# EAGLE design CCS811 Rev B (EAGLE 6.6.0)
COMPANY: ADAFRUIT INDUSTRIES; DRAWN: KTOWN; REV: A
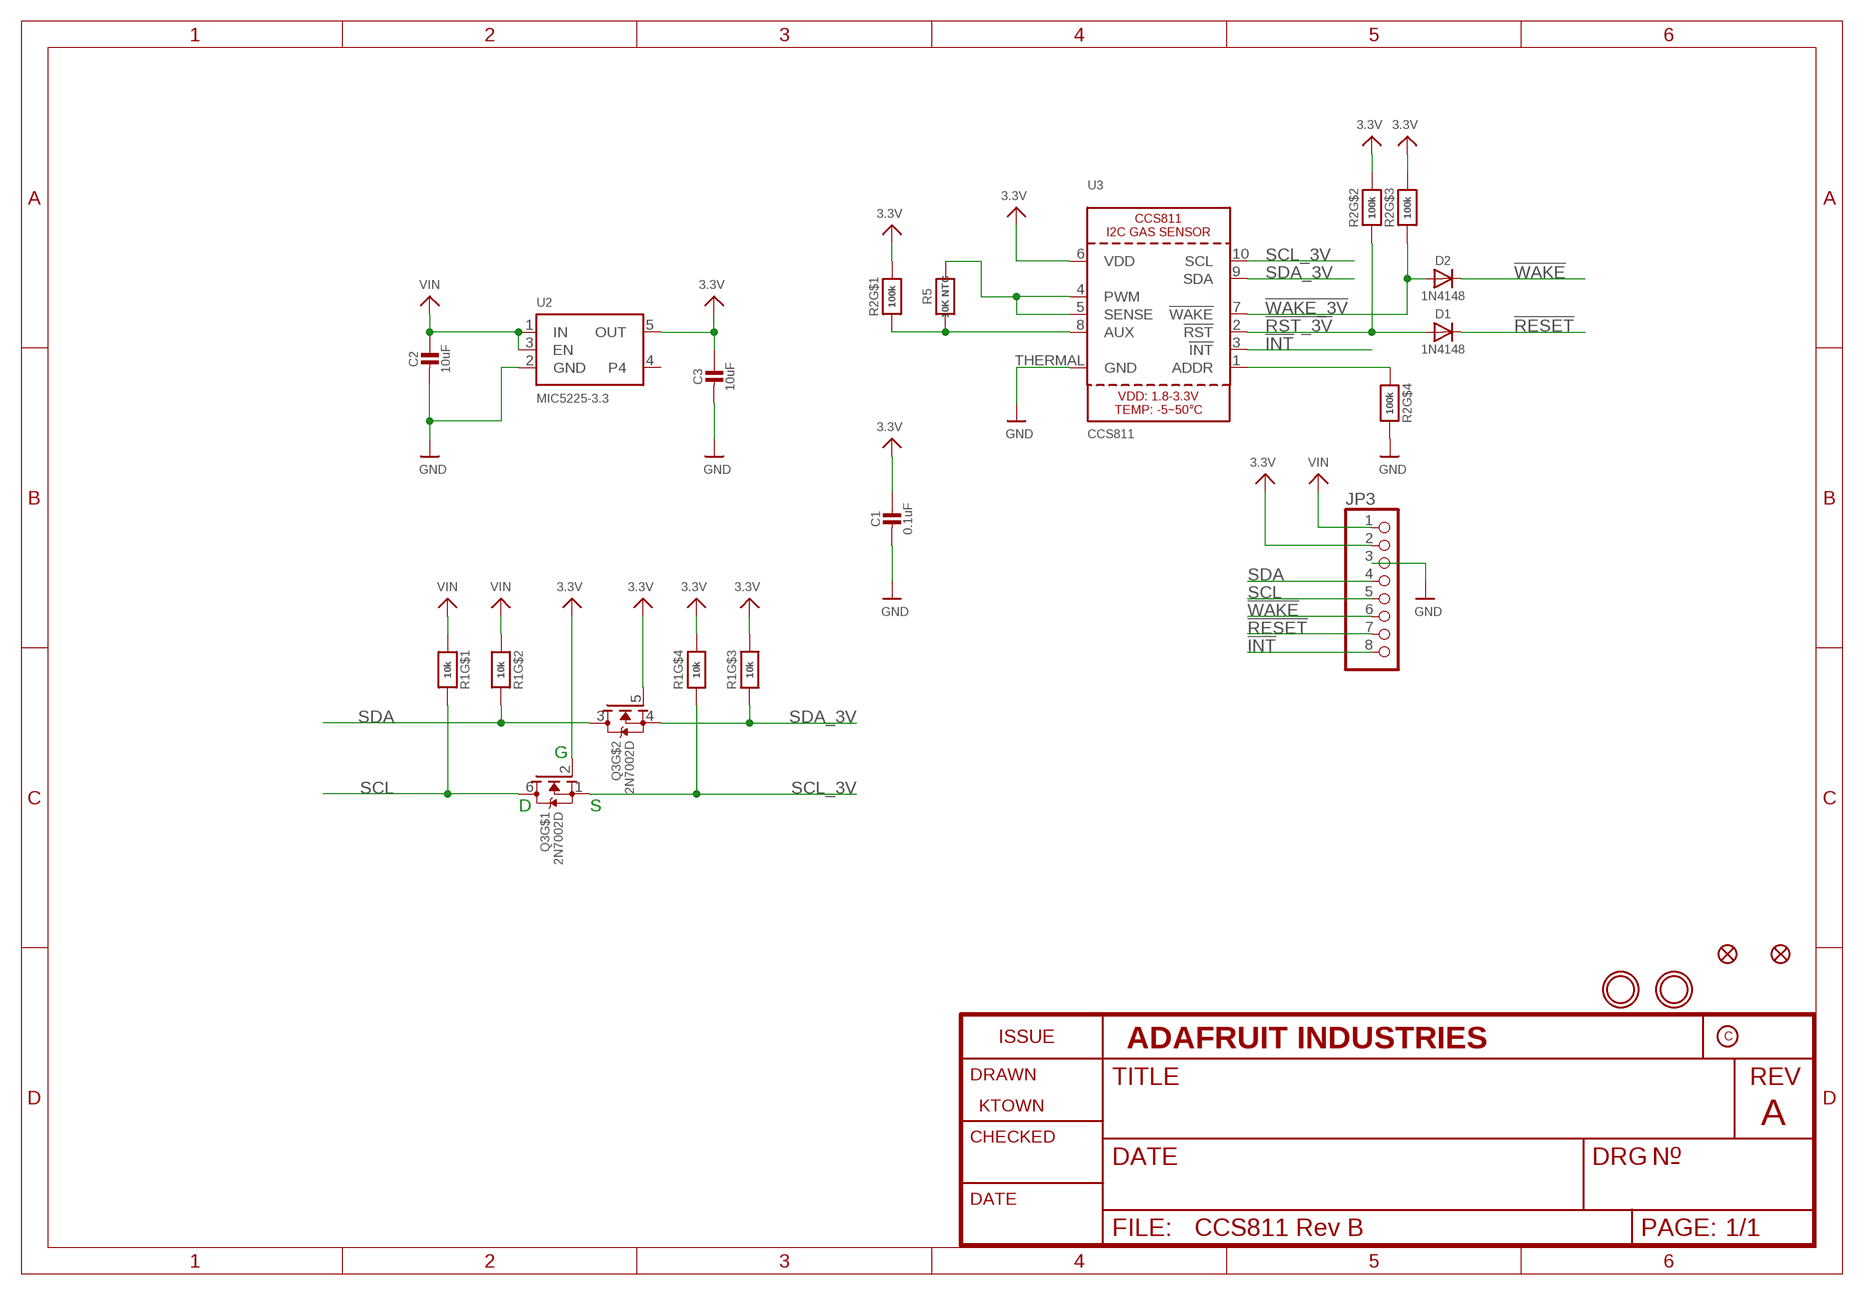
[diagram p0: schematic, sheet 1]

## Parts
C1  0.1uF  CAP_CERAMIC0603_NO  [0603-NO]
C2  10uF  CAP_CERAMIC0805-NOOUTLINE  [0805-NO]
C3  10uF  CAP_CERAMIC0805-NOOUTLINE  [0805-NO]
D1  1N4148  DIODESOD-323  [SOD-323]
D2  1N4148  DIODESOD-323  [SOD-323]
FID1  FIDUCIAL_1MM  [FIDUCIAL_1MM]
FID2  FIDUCIAL_1MM  [FIDUCIAL_1MM]
JP3  HEADER-1X870MIL  [1X08_ROUND_70]
Q3  2N7002D  MOSFET-N_DUAL  [SOT363]
R1  10k  RESISTOR_4PACK  [RESPACK_4X0603]
R2  100k  RESISTOR_4PACK  [RESPACK_4X0603]
R5  10K NTC  RESISTOR_0402  [_0402]
U2  MIC5225-3.3  VREG_SOT23-5  [SOT23-5]
U3  CCS811  [CCS811]
U$3  MOUNTINGHOLE2.5  [MOUNTINGHOLE_2.5_PLATED]
U$4  MOUNTINGHOLE2.5  [MOUNTINGHOLE_2.5_PLATED]

## Nets
3.3V: C1.1 C3.1 JP3.2 Q3.2(G) Q3.5(G) R1.3 R1.4 R2.6 R2.7 R2.8 U2.5(OUT) U3.6(VDD)
!INT: JP3.8 U3.3(!INT)
!RESET: D1.C JP3.7
!RST_3V: D1.A R2.2 U3.2(!RST)
!WAKE: D2.C JP3.6
!WAKE_3V: D2.A R2.3 U3.7(!WAKE)
GND: C1.2 C2.2 C3.2 JP3.3 R2.5 U2.2(GND) U3.THERMAL(GND)
N$1: R5.2 U3.4(PWM) U3.5(SENSE)
N$2: R2.1 R5.1 U3.8(AUX)
N$3: R2.4 U3.1(ADDR)
SCL: JP3.5 Q3.6(D) R1.8
SCL_3V: Q3.1(S) R1.5 U3.10(SCL)
SDA: JP3.4 Q3.3(D) R1.7
SDA_3V: Q3.4(S) R1.6 U3.9(SDA)
VIN: C2.1 JP3.1 R1.1 R1.2 U2.1(IN) U2.3(EN)
Unconnected: U2.4

## Notes on the sheet
- G
- D | S

## Library data of the parts
C1-C3 = microbuilder:CAP_CERAMIC: Ceramic Capacitors For new designs, use the packages preceded by an '_' character since they are more reliable: The following footprints should be used on most boards: _0402 - Standard footprint for regular board layouts _0603 - Standard footprint for regular board layouts _0805 - Standard footprint for regular board layouts _1206 - Standard footprint for regular board layouts For extremely tight-pitch boards where space is at a premium, the following 'micro-pitch' footprints can be used (smaller pads, no silkscreen outline, etc.): _0402MP - Micro-pitch footprint for very dense/compact boards _0603MP - Micro-pitch footprint for very dense/compact boards _0805MP - Micro-pitch footprint for very dense/compact boards _1206MP - Micro-pitch footprint for very dense/compact boards
D1 D2 = microbuilder:DIODE: Diode SMA Model Volts Amps Type Vf Ir Digikey # Notes SSA34-E3 40V 3A Schottky 480mV @ 3A 200uA @ 40V SSA34-E3/61TGITR-ND CDBA120-G 20V 1A Schottky 500mV @ 1A 500uA @ 20V 641-1014-6-ND REEL MBRA210 10V 2A Schottky 350mV @ 2A 700uA @ 10V MBRA210LT3 SOD-123 Model Volts Amps Type Vf Ir Order # Notes BAT54T1G 30V 200mA Schottky 800mV @ 200mA 2uA @ 25V BAT54T1GOSTR-ND B0530W 30V 500mA Schottky 430mV @ 500mA 130uA @ 30V B0530W-FDICT-ND REEL MBR120 20V 1A Schottky 340mV @ 1A MBR120VLSFT1GOSCT-ND SOD-323 Model Volts Amps Type Vf Ir Order # Notes PMEG2005EJ 20V 500mA Schottky 355mV @ 500mA 568-4110-1-ND ZLLS410 10V 570mA Schottky 380mV @ 570mA ZLLS410CT-ND 1N4148WS 75V 150mA Silicon/Simple 1V 1N4148WSFSCT-ND REEL SOD-523 Model Volts Amps Type Vf Ir Order # Notes BAT54XV2 30V 200mA Schottky 0.8V @ 100mA BAT54XV2CT-ND TB751S 30V 30mA Schottky RB751S-40TE61CT-ND SOT23-R/W (R = Solder Paste/Reflow Ovens, W = Hand-Soldering) Model Volts Amps Type Vf Ir Order # Notes BAT54FILM 40V 300mA Schottky 497-7162-1-ND POWERDI-5 Model Volts Amps Type Vf Ir Order # Notes PDS560 60V 5A Schottky 670mV @ 5A 150uA @ 60V PDS560DICT-ND
FID1 FID2 = microbuilder:FIDUCIAL: Fiducial Alignment Points Various fiducial points for machine vision alignment.; BOM: EXCLUDE
JP3 = microbuilder:HEADER-1X8: PIN HEADER
Q3 = microbuilder:MOSFET-N_DUAL: Dual N-Channel MOSFET SOT363 (2.0x1.25mm) 2N7002PS - 60V, 320mA [Digikey: 568-5984-1-ND]
R1 R2 = microbuilder:RESISTOR_4PACK: Resistor Packs (4 resistors) 4 x 0603 10K 1/16W - Digikey: YC164J-10KCT-ND
R5 = microbuilder:RESISTOR: Resistors For new designs, use the packages preceded by an '_' character since they are more reliable: The following footprints should be used on most boards: _0402 - Standard footprint for regular board layouts _0603 - Standard footprint for regular board layouts _0805 - Standard footprint for regular board layouts _1206 - Standard footprint for regular board layouts For extremely tight-pitch boards where space is at a premium, the following 'micro-pitch' footprints can be used (smaller pads, no silkscreen outline, etc.): _0402MP - Micro-pitch footprint for very dense/compact boards _0603MP - Micro-pitch footprint for very dense/compact boards _0805MP - Micro-pitch footprint for very dense/compact boards _1206MP - Micro-pitch footprint for very dense/compact boards
U2 = microbuilder:VREG_SOT23-5: SOT23-5 Fixed Voltage Regulators Part Current Out V Out V In V Dropout θJA (°C/W) TJ (°C) Digikey Part No. ADP121 150mA 3.3V 3.4-5.5V 0.09V @ 150mA -- -- ADP121-AUJZ33R7CT-ND ADP121 150mA 3.0V 3.1-5.5V 0.09V @ 150mA -- -- ADP121-AUJZ30R7CT-ND ADP122 300mA 3.3V 3.4-5.5V 0.085V @ 300mA -- -- ADP122AUJZ-3.3-R7CT-ND ADP1712 300mA 3.3V 3.5-5.5V 0.17V @ 300mA -- -- ADP1712AUJZ-3.3-R7TR-ND AP7311 (Low Cost) 150mA 3.3V 3.5-6V 0.15V @ 150mA -- -- AP7311-33WG-7DICT-ND LD39015M18R 150mA 1.8V 1.9V-5.5V 0.08V @ 100mA -- -- 497-6977-1-ND LP2985A-33DBVR 150mA 3.3V 3.3-16V 0.28V @ 150mA 206 150 296-18479-1-ND MCP1824T-3302E/OT 300mA 3.3V 3.5V-6V 0.2V @ 300mA -- -- MCP1824T-3302E/OTCT-ND MIC5205-2.5YM5 TR 150mA 2.5V 2.7-16V 0.165V @ 150mA -- -- 576-1257-2-ND MIC5205-3.0YM5 TR 150mA 3.0V 3.2V-16V 0.165V @ 150mA -- -- 576-1258-2-ND MIC5205-3.3YM5 TR 150mA 3.3V 3.5V-16V 0.165V @ 150mA -- -- 576-1259-2-ND TPS780330220 150mA 3.3V+2.2V 3.6-5.5V 250mV Max -- -- 296-23332-1-ND TDA3663/N1,135 100mA 3.3V 3.5-45V 0.18V @ 50mA -- -- 568-5343-1-ND Max operating temp can be calculated using θJA, TJ (max junction temperature), and power in watts. Set the "Maximum Ambient Temperature" until it reaches TJ ("Max Junction Temperature"), which is the absolute limit for safe use of the regulator: Heat Sink Temperature Calculator <http://www.daycounter.com/Calculators/Heat-Sink-Temperature-Calculator.phtml> For example, With 12V source into a 3.3V LP2985 and a 30mA load, we are dissipating (12V-3.3V) * 0.03A = 0.261W. With a θJA of 206 °C/W, a TJ of 150°C, and 261mW we can safely use the chip without a heat sink up to 75°C (=147.1°C Junction Temperature).
U3 = microbuilder:CCS811: CCS811 - I2C Gas and Air Quality Sensor
U$3 U$4 = microbuilder:MOUNTINGHOLE: Mounting Hole For #2 screws (0.086"/2.18mm width, 0.094"/2.4mm hole) use 2.5mm; BOM: EXCLUDE

## Board
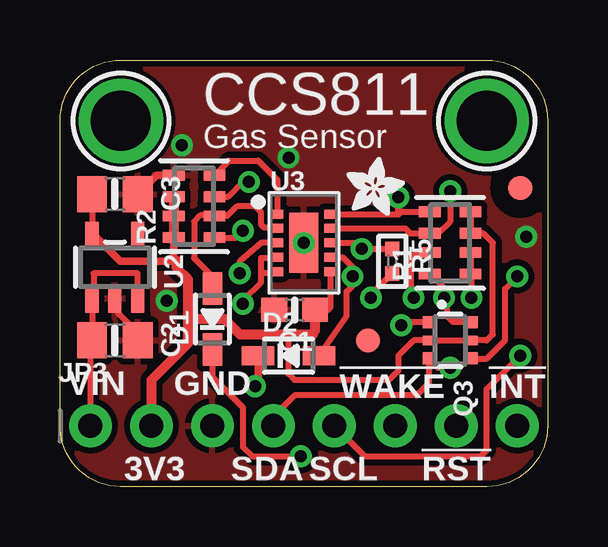
[diagram p1: board, top side]
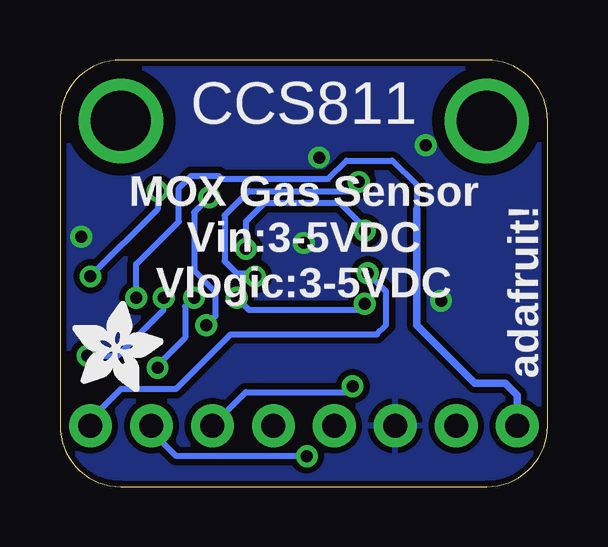
[diagram p2: board, bottom side, seen from below]

Size 20.32 x 17.78 mm. Coordinates in mm from the lower left corner, seen from the top.
Outline: 20.32,15.24 20.32,2.54 arc-90 17.78,0 2.54,0 arc-90 0,2.54 0,15.24 arc-90 2.54,17.78 17.78,17.78 arc-90 20.32,15.24
Copper layers (1*16): Top 0.035mm / dielectric 1.5mm / Bottom 0.035mm
Design rules "adafruit *": minimum track width 8mil, minimum drill 15.5mil, track to track 8mil, track to pad 8mil, pad to pad 8mil, via to via 8mil, smd to smd 8mil, copper to edge 10mil, drill to drill 8mil, minimum pad ring 10mil, minimum via ring 8mil, stop-mask expansion 2mil, vias tented up to drill 20mil, thermal gap 10mil

### Footprints (pad centres in the part's own frame; a part is rotated, then mirrored left to right if it is on the bottom)
0603-NO = smd 1.075 x 1: 1 -0.85,0; 2 0.85,0
0805-NO = smd 1.24 x 1.5: 1 -0.95,0; 2 0.95,0
SOD-323 = smd 1.35 x 0.8: A 1.27,0; C -1.27,0
FIDUCIAL_1MM = smd 1 x 1: 1 0,0
1X08_ROUND_70 = drill 1 pad 1.778: 1 -8.89,0; 2 -6.35,0; 3 -3.81,0; 4 -1.27,0; 5 1.27,0; 6 3.81,0; 7 6.35,0; 8 8.89,0
SOT363 = smd 0.5 x 0.5: 1 -0.75,-0.9; 3 0.75,-0.9; 4 0.75,0.9; 6 -0.75,0.9 | smd 0.4 x 0.5: 2 0,-0.9; 5 0,0.9
RESPACK_4X0603 = smd 0.45 x 0.9: 1 -1.3,-0.85; 2 -0.4,-0.85; 3 0.4,-0.85; 4 1.3,-0.85; 5 1.3,0.85; 6 0.4,0.85; 7 -0.4,0.85; 8 -1.3,0.85
_0402 = smd 0.6 x 0.6: 1 -0.508,0; 2 0.508,0
SOT23-5 = smd 0.55 x 1.2: 1 -0.95,-1.3; 2 0,-1.3; 3 0.95,-1.3; 4 0.95,1.3; 5 -0.95,1.3
CCS811 = smd 0.5 x 0.375: 1 -1.1,1.2; 2 -1.1,0.6; 3 -1.1,0; 4 -1.1,-0.6; 5 -1.1,-1.2; 6 1.1,-1.2; 7 1.1,-0.6; 8 1.1,0; 9 1.1,0.6; 10 1.1,1.2 | smd 1.2 x 2.5: THERMAL 0,0
MOUNTINGHOLE_2.5_PLATED = drill 2.5 pad 3.2: P$1 0,0

### Placement (x,y rotation side)
C1  9.78,7.37 180 top
C2  2.29,6.1 0 top
C3  2.29,12.19 0 top
D1  6.35,6.99 90 top
D2  9.53,5.46 0 top
FID1  12.83,6.1 0 top
FID2  19.18,12.45 0 top
JP3  10.16,2.54 0 top
Q3  16.26,6.1 270 top
R1  16.26,10.16 90 top
R2  5.59,11.68 90 top
R5  13.84,9.4 270 top
U2  2.29,9.14 0 top
U3  10.16,10.16 0 top
U$1  [ADAFRUIT_3.5MM]  19.81,3.94 0 bottom
U$3  2.54,15.24 0 top
U$4  17.78,15.24 0 top
U$8  [ADAFRUIT_2.5MM]  11.94,11.3 0 top

### Tracks (layer width: path | path; a pad name or v marks a point on that pad's centre or on a via)
3.3V
  Top 0.254: C3.1 U2.5 | 17.18,11.46 R1.4 R1.3 17.63,10.56 18.03,10.16 18.03,6.35 17.78,6.1 Q3.5 Q3.2 14.73,6.1 14.1,5.46 14.1,4.84 13.71,4.45 9.78,4.45 9.53,4.7 9.53,6.35 | U3.6 11.26,7.45 11.18,7.37 C1.1
  Top 0.305: R2.8 4.74,9.53 4.87,9.4 2.51,9.4 1.46,10.44 U2.5
  Top 0.406: R2.6 R2.7 R2.8 | JP3.2 3.81,4.45 5.33,5.97 5.33,6.99 | 5.33,6.99 5.33,8.64 4.87,9.11 4.87,9.4 | 5.33,6.99 6.86,6.99 7.49,6.35 9.53,6.35 10.54,6.35 10.5,6.39 10.63,6.52 C1.1
!INT  (via drill 0.5)
  Top 0.254: U3.3 8.38,10.16 7.49,9.4 v7.49,8.89
  Bottom 0.254: v7.49,8.89 6.73,8.13 6.73,6.73 7.11,6.35 13.21,6.35 15.49,4.06 17.78,4.06 19.05,2.79 JP3.8
!RESET  (via drill 0.5)
  Top 0.254: D1.C 6.35,4.57 7.62,3.3 7.62,1.65 8,1.27 v10.03,1.27
  Bottom 0.254: v10.03,1.27 15.47,1.27 16.51,2.31 JP3.7
!RST_3V
  Top 0.254: U3.2 8.93,10.76 8.89,10.79 8.51,10.79 8.38,10.92 8.38,11.43 8.13,11.68 7.37,11.68 6.97,11.28 R2.2 6.53,11.28 6.55,11.3 5.84,11.3 5.59,11.05 5.59,9.53 6.35,8.76 D1.A
!WAKE  (via drill 0.5)
  Top 0.254: D2.C 8.38,5.59
  Top 0.305: D2.C 8.26,4.32 v8.13,4.19
  Bottom 0.254: JP3.6 12.57,3.94 8.38,3.94 v8.13,4.19
!WAKE_3V  (via drill 0.5)
  Top 0.254: U3.7 11.78,9.56 12.19,9.14 v12.19,8.76 12.19,8.38 11.94,8.13 11.94,7.11 D2.A | R2.3 7,12.08 7.62,12.7 v7.87,12.7
  Bottom 0.254: v12.19,8.76 12.32,8.89 12.95,8.89 13.46,9.4 13.46,11.3 12.45,12.32 8.26,12.32 v7.87,12.7
GND  (via drill 0.5)
  Top 0.254: 2.41,7.37 2.41,7.24 2.92,6.73 2.92,6.41 C2.2
  Top 0.305: C3.2 4.03,12.98 R2.5 | 2.41,7.37 2.29,7.49 U2.2
  other vias: 10.16,10.16 4.45,7.75 9.53,13.72 19.43,10.41 5.08,14.22
  pour Top (isolate 0.254): 0,0 0,17.78 20.32,17.78 20.32,0
  pour Bottom (isolate 0.254): 0,0 0,17.78 20.32,17.78 20.32,0
N$1  (via drill 0.5)
  Top 0.254: U3.4 9.03,9.53 8.38,9.53 8.38,8.89 | U3.5 8.99,8.89 8.38,8.89 | v7.62,7.62 7.62,7.75 8.38,8.51 8.38,8.89 | R5.2 12.95,8 v12.95,7.87
  Bottom 0.254: v12.95,7.87 12.45,7.37 7.87,7.37 v7.62,7.62
N$2  (via drill 0.5)
  Top 0.254: R2.1 7.34,10.38 v7.62,10.67 | U3.8 12.32,10.16 v12.57,9.91 R5.1
  Bottom 0.254: v12.57,9.91 12.57,11.05 11.81,11.81 8.64,11.81 7.62,10.79 v7.62,10.67
N$3
  Top 0.254: U3.1 9.06,12.78 8.26,13.59 7.04,13.59 R2.4
SCL  (via drill 0.5)
  Top 0.254: JP3.5 12.7,1.27 17.53,1.27 17.78,1.52 17.78,4.06 v19.18,5.46 | R1.8 16,8.26 v16,7.87 16.13,7.75 16.13,7.11 16.38,6.86 17.14,6.86 Q3.6
  Bottom 0.254: v19.18,5.46 17.91,5.46 16,7.37 v16,7.87
SCL_3V  (via drill 0.5)
  Top 0.254: 14.1,11.33 v14.1,12.06 | 11.3,11.4 U3.10 11.29,11.33 14.1,11.33 | 14.1,11.33 14.22,11.46 R1.5 | Q3.1 14.34,6.85 v14.22,6.73
  Bottom 0.254: v14.1,12.06 14.73,11.43 14.73,9.02 13.84,8.13 13.84,7.11 v14.22,6.73
SDA  (via drill 0.5)
  Top 0.254: v14.73,7.87 14.61,8 14.61,9.53 14.84,9.76 R1.7 | JP3.4 8.89,2.92 9.78,3.81 14.86,3.81 15.36,4.31 Q3.3 15.75,4.95 v16.26,4.95
  Bottom 0.254: v14.73,7.87 15.1,7.5 15.1,6.21 16.26,5.06 v16.26,4.95
SDA_3V  (via drill 0.5)
  Top 0.254: v16.26,12.32 16.26,11.05 15.77,10.56 R1.6 15.39,10.54 14.61,10.54 14.39,10.76 U3.9 | Q3.4 17.17,5.33 17.78,5.33 18.54,6.1 18.54,8.26 v19.05,8.76
  Bottom 0.254: v16.26,12.32 16.26,11.56 v19.05,8.76
VIN  (via drill 0.5)
  Top 0.254: R1.2 R1.1 17.08,8.89 16.89,8.89 17.14,8.64 v17.14,7.87 | U2.3 3.24,8.89 1.4,8.89 1.4,7.84 U2.1 C2.1 1.27,6.03 JP3.1
  Bottom 0.254: v17.14,7.87 17.14,9.27 15.37,11.05 15.37,12.45 14.86,12.95 13.72,12.95 13.59,12.83 9.14,12.83 8.38,13.59 6.48,13.59 5.46,12.57 5.46,11.56
  Bottom 0.305: JP3.1 1.27,3.81 1.78,4.32 3.05,4.32 5.46,6.73 5.46,11.56

### Text on the board
tPlace: CCS811 | Gas Sensor | VIN | GND | !WAKE | !INT | 3V3 | SDA | SCL | !RST
bPlace: CCS811 | MOX Gas Sensor / Vin:3-5VDC / Vlogic:3-5VDC | adafruit!